# Altium schematic sheet MK.SchDoc
size A4
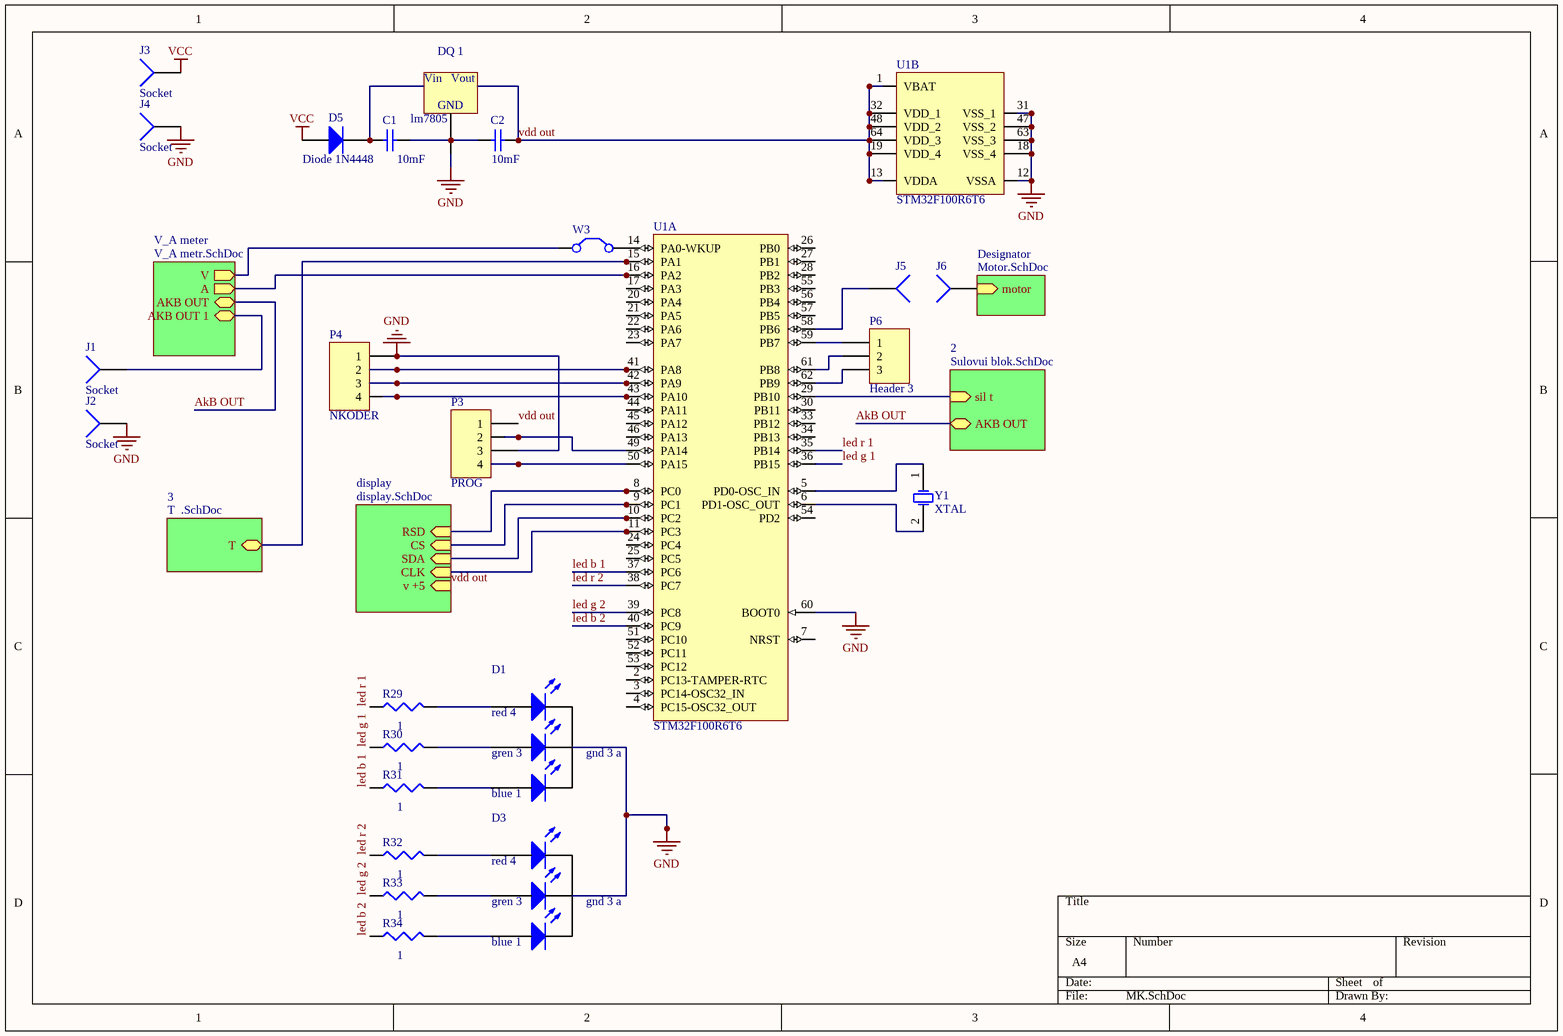
[diagram p0: MK.SchDoc]

## Parts
C1  value 10mF  [C1206]  (hidden comment: Cap Semi)
C2  value 10mF  [C1206]  (hidden comment: Cap Semi)
D1  LED1  [PCBComponent_1]  (value not drawn)
D3  LED1  [PCBComponent_1]  (value not drawn)
D5  Diode 1N4448  [DO-35]
DQ_1  lm7805  [TO-220AB]
J1  Socket  [PIN1]
J2  Socket  [PIN1]
J3  Socket  [PIN1]
J4  Socket  [PIN1]
J5  Socket  [PIN1]  (value not drawn)
J6  Socket  [PIN1]  (value not drawn)
P3  PROG  [HDR1X4]
P4  NKODER  [HDR1X4]
P6  Header 3  [HDR1X3]
R29  value 1  [J1-0603]  (hidden comment: Res3)
R30  value 1  [J1-0603]  (hidden comment: Res3)
R31  value 1  [J1-0603]  (hidden comment: Res3)
R32  value 1  [J1-0603]  (hidden comment: Res3)
R33  value 1  [J1-0603]  (hidden comment: Res3)
R34  value 1  [J1-0603]  (hidden comment: Res3)
U1  STM32F100R6T6  [STM-LQFP64_N]  (parts A,B of 2)
W3  Jumper  [PCBComponent_1]  (value not drawn)
Y1  XTAL  [PCBComponent_1]

## Sub-sheets
2 = Sulovui blok.SchDoc: sil t (in), AKB OUT
3 = T  .SchDoc: T
Designator = Motor.SchDoc: motor (in)
display = display.SchDoc: RSD (in), CS (in), CLK (in), SDA (in), v +5 (in)
V_A meter = V_A metr.SchDoc: AKB OUT 1, AKB OUT, A (out), V (out)

## Nets
GND: C1.2 C2.1 D1.2(gnd) D3.2(gnd) DQ_1.2(GND) J2.1 J4.1 P3.3 P4.1 U1.12(VSSA) U1.18(VSS_4) U1.31(VSS_1) U1.47(VSS_2) U1.60(BOOT0) U1.63(VSS_3)
VCC: D5.1(A) J3.1
AkB OUT: sheet 2/AKB OUT, sheet V_A meter/AKB OUT
led b 1: R31.1 U1.37(PC6)
led b 2: R34.1 U1.40(PC9)
led g 1: R30.1 U1.36(PB15)
led g 2: R33.1 U1.39(PC8)
led r 1: R29.1 U1.35(PB14)
led r 2: R32.1 U1.38(PC7)
vdd out: C2.2 DQ_1.3(Vuot) P3.1 U1.1(VBAT) U1.13(VDDA) U1.19(VDD_4) U1.32(VDD_1) U1.48(VDD_2) U1.64(VDD_3) ; sheet display/v +5
NetC1_1: C1.1 D5.2(K) DQ_1.1(Vin)
NetD1_1: D1.1(blue) R31.2
NetD1_3: D1.3(gren) R30.2
NetD1_4: D1.4(red_k) R29.2
NetD3_1: D3.1(blue) R34.2
NetD3_3: D3.3(gren) R33.2
NetD3_4: D3.4(red_k) R32.2
NetJ1_1: J1.1 ; sheet V_A meter/AKB OUT 1
NetJ5_1: J5.1 U1.58(PB6)
NetJ6_1: J6.1 ; sheet Designator/motor
NetP3_2: P3.2 U1.49(PA14)
NetP3_4: P3.4 U1.50(PA15)
NetP4_2: P4.2 U1.41(PA8)
NetP4_3: P4.3 U1.42(PA9)
NetP4_4: P4.4 U1.43(PA10)
NetP6_1: P6.1 U1.59(PB7)
NetP6_2: P6.2 U1.61(PB8)
NetP6_3: P6.3 U1.62(PB9)
NetU1_5: U1.5(PD0-OSC_IN) Y1.1(OSC1)
NetU1_6: U1.6(PD1-OSC_OUT) Y1.2(OSC2)
NetU1_8: U1.8(PC0) ; sheet display/RSD
NetU1_9: U1.9(PC1) ; sheet display/CS
NetU1_10: U1.10(PC2) ; sheet display/SDA
NetU1_11: U1.11(PC3) ; sheet display/CLK
NetU1_14: U1.14(PA0-WKUP) W3.2(C2)
NetU1_15: U1.15(PA1) ; sheet 3/T
NetU1_16: U1.16(PA2) ; sheet V_A meter/A
NetU1_29: U1.29(PB10) ; sheet 2/sil t
NetW3_1: W3.1(C1) ; sheet V_A meter/V

Not connected (* = marked no-connect by the designer): U1 2(PC13-TAMPER-RTC) 3(PC14-OSC32_IN) 4(PC15-OSC32_OUT) 7(NRST) 17(PA3) 20(PA4) 21(PA5) 22(PA6) 23(PA7) 24(PC4) 25(PC5) 26(PB0) 27(PB1) 28(PB2) 30(PB11) 33(PB12) 34(PB13) 44(PA11) 45(PA12) 46(PA13) 51(PC10) 52(PC11) 53(PC12) 54(PD2) 55(PB3) 56(PB4) 57(PB5)

## Notes on the sheet
- (in symbol LED1) red 4; gren 3; gnd 3 a; blue 1
- (in symbol lm7805) Vout

## Library data of the parts
C1 C2 = Cap Semi: Capacitor (Semiconductor SIM Model); Published: 8-Jun-2000; LatestRevisionDate: 29-May-2009; LatestRevisionNote: IPC-7351 Footprint Added.; PackageReference: C1206; Publisher: Altium Limited; PackageDescription: Chip Capacitor
D1 D3 = LED1: Typical RED GaAs LED; Published: 8-Jun-2000; LatestRevisionDate: 08-Jul-2005; LatestRevisionNote: Mech Layer 1 removed.; PackageReference: LED-1; Publisher: Altium Limited; PackageDescription: LED; 2 Leads
D5 = Diode 1N4448: High Conductance Fast Diode; Published: 8-Jun-2000; LatestRevisionDate: 17-Jul-2002; LatestRevisionNote: Re-released for DXP Platform.; DatasheetVersion: 1997; PackageReference: DO-35; Publisher: Altium Limited; PackageDescription: Diode, Axial; Body 3.8 x 1.9 mm (LxDia. max), Lead Dia. 0.53 mm (max); Code_JEDEC: DO-204-AH; ComponentLink1Description: Manufacturer Link; ComponentLink1URL: http://www.fairchildsemi.com/; ComponentLink2Description: Datasheet; ComponentLink2URL: http://www.fairchildsemi.com/ds/1N%2F1N4448.pdf
P3 P4 = Header 4: Header, 4-Pin; LatestRevisionDate: 17-Jul-2002; LatestRevisionNote: Re-released for DXP Platform.; Publisher: Altium Limited
P6 = Header 3: Header, 3-Pin; LatestRevisionDate: 17-Jul-2002; LatestRevisionNote: Re-released for DXP Platform.; Publisher: Altium Limited
R29-R34 = Res3: Resistor; Published: 8-Jun-2000; LatestRevisionDate: 29-May-2009; LatestRevisionNote: IPC-7351 Footprint Added.; PackageReference: J1-0603; Publisher: Altium Limited; PackageDescription: Chip Resistor
U1 = STM32F100R6T6: ARM Cortex-M3 32-bit MCU, 32 KB Flash, 4 KB Internal RAM, 51 I/Os, 64-pin LQFP, -40 to 85 degC, Tray; A/D Converter: 1x12-bit (16 Channel); D/A Converter: 2x12-bit (2 Channel); FLASH Size (Prog) (kB): 32; I/Os (High Current): 51; Internal RAM Size (kB): 4; Operating Frequency(F) (Processor speed) (MHz): 24; Supply Voltage(Vcc) min (V): 2; DatasheetVersion: Rev. 7; PackageVersion: Rev. 4, 06/2013; PackageReference: LQFP64; PackageDescription: 64-Pin Low Profile Quad Flat Package, 10 x 10 mm Body, 0.5 mm Pitch; Supplier 1: Mouser; Supplier Part Number 1: N/A; Core: ARM Cortex-M3; Packing: Tray; Mounting Technology: Surface Mount; PartNumber: STM32F100R6T6; ComponentLink1Description: Manufacturer URL; ComponentLink1URL: http://www.st.com/web/en/home.html; ComponentLink2Description: Datasheet; ComponentLink2URL: http://www.st.com/st-web-ui/static/active/en/resource/technical/document/datasheet/CD00251732.pdf; ComponentLink3Description: Package Specification; ComponentLink3URL: http://www.st.com/st-web-ui/static/active/en/resource/technical/document/datasheet/DM00037051.pdf
W3 = Jumper: Jumper Wire; Published: 24-Mar-1999; LatestRevisionDate: 17-Jul-2002; LatestRevisionNote: Re-released for DXP Platform.; PackageReference: RAD-0.2; Publisher: Altium Limited; PackageDescription: Radial Cap, Thru-Hole; 2 Leads; 0.2 in Pin Spacing
Y1 = XTAL: Crystal Oscillator; Published: 8-Jun-2000; LatestRevisionDate: 17-Jul-2002; LatestRevisionNote: Re-released for DXP Platform.; PackageReference: R38; Publisher: Altium Limited; PackageDescription: Crystal, Thru-Hole; 2 Leads; Body 3.1 x 8.2 mm (Dia.xH)
DQ_1 = lm7805: Supplier 1: Farnell; Supplier Part Number 1: 9490175
J1-J6 = Socket: LatestRevisionDate: 17-Jul-2002; LatestRevisionNote: Re-released for DXP Platform.; Publisher: Altium Limited